# EAGLE board Synth (EAGLE 9.6.2), part 1 of 3
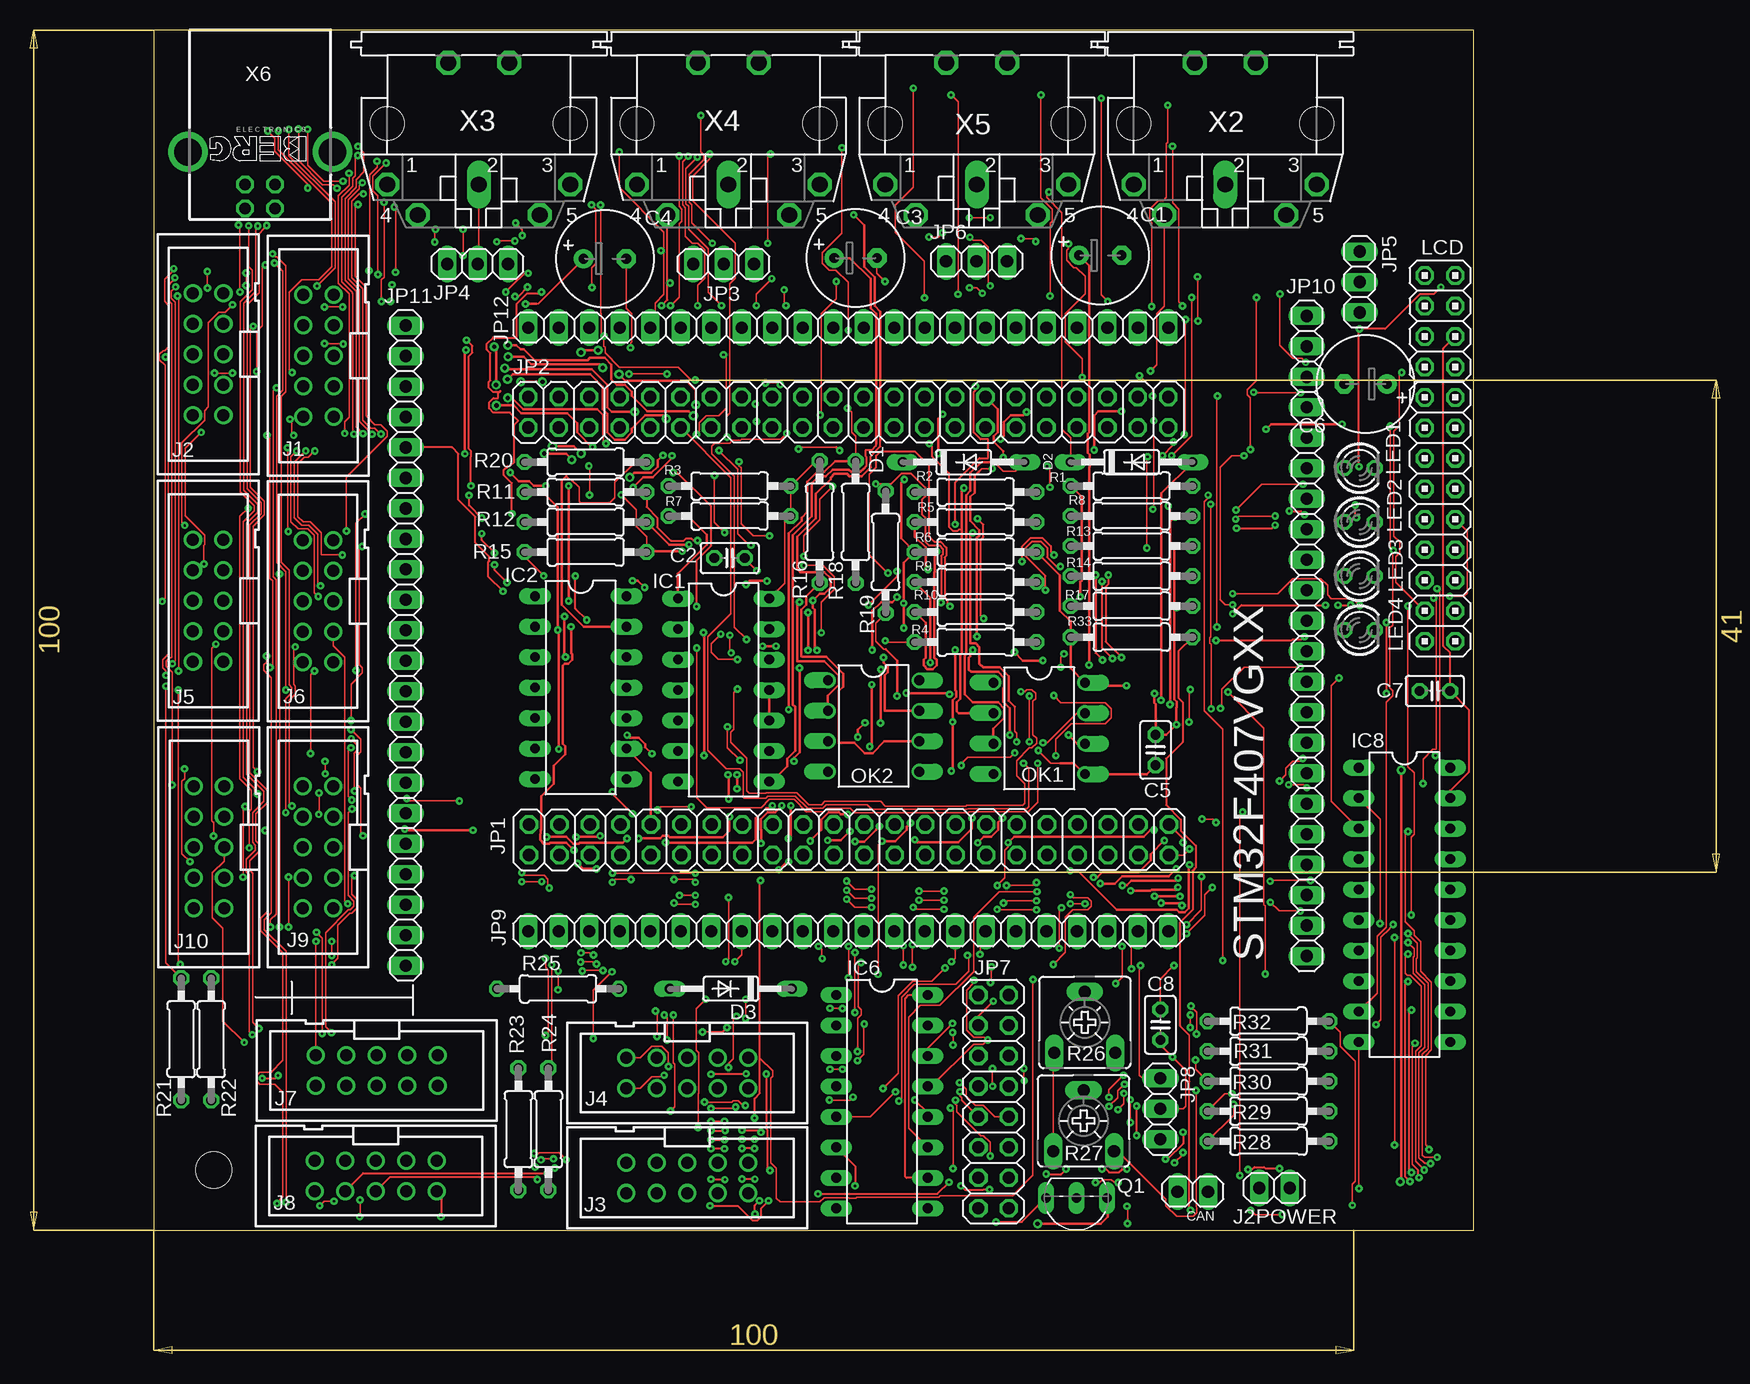
[diagram p3: board, top side]
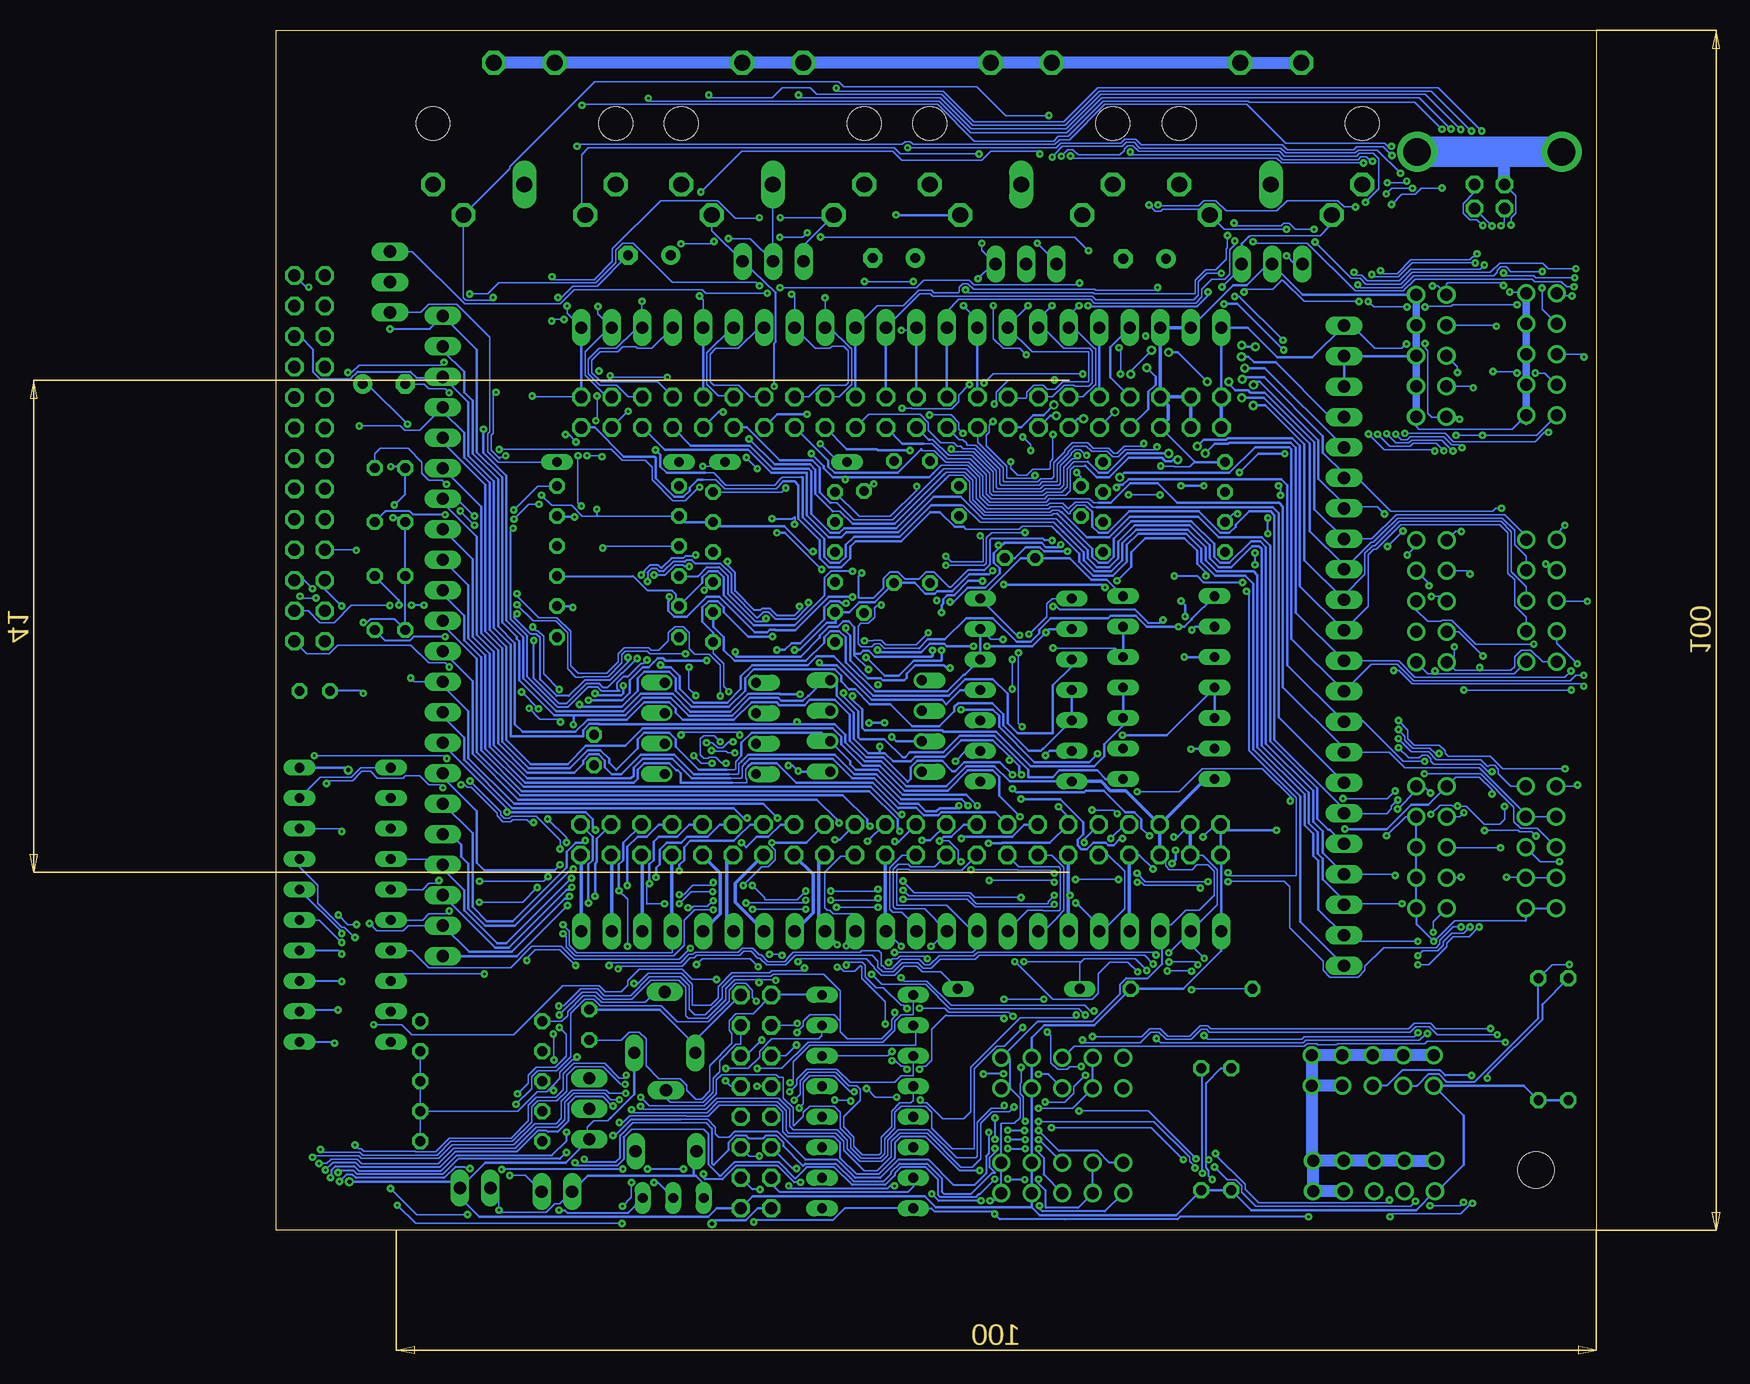
[diagram p4: board, bottom side, seen from below]

Size 110 x 100 mm. Coordinates in mm from the lower left corner, seen from the top.
Outline: 0,0 110,0 110,100 0,100 0,0
Copper layers (1*16): Top 0.035mm / dielectric 1.5mm / Bottom 0.035mm
Design rules "default *": minimum track width 0.13mm, minimum drill 0.2mm, track to track 0.15mm, track to pad 0.15mm, pad to pad 0.15mm, via to via 0.15mm, smd to smd 0.15mm, copper to edge 0.13mm, drill to drill 0.13mm, minimum pad ring 10mil, minimum via ring 8mil, stop-mask expansion 4mil, vias tented up to drill 0mil, thermal gap 10mil
Net classes: 0 default: clearance 0.15 mm
Holes 3 mm at 5,5

## Footprints (pad centres in the part's own frame; a part is rotated, then mirrored left to right if it is on the bottom)
E3,5-8 = drill 0.813 pad 1.6: + -1.778,0 | drill 0.813 pad 1.6 octagon: - 1.778,0
C025-025X050 = drill 0.813 octagon: 1 -1.27,0; 2 1.27,0
1X02 = drill 1.016 long: 1 -1.27,0; 2 1.27,0
DO35-10 = drill 0.813 long: A 5.08,0; C -5.08,0
DIL14 = drill 0.813 long: 1 -7.62,-3.81; 2 -5.08,-3.81; 3 -2.54,-3.81; 4 0,-3.81; 5 2.54,-3.81; 6 5.08,-3.81; 7 7.62,-3.81; 8 7.62,3.81; 9 5.08,3.81; 10 2.54,3.81; 11 0,3.81; 12 -2.54,3.81; 13 -5.08,3.81; 14 -7.62,3.81
DIL16 = drill 0.813 long: 1 -8.89,-3.81; 2 -6.35,-3.81; 3 -3.81,-3.81; 4 -1.27,-3.81; 5 1.27,-3.81; 6 3.81,-3.81; 7 6.35,-3.81; 8 8.89,-3.81; 9 8.89,3.81; 10 6.35,3.81; 11 3.81,3.81; 12 1.27,3.81; 13 -1.27,3.81; 14 -3.81,3.81; 15 -6.35,3.81; 16 -8.89,3.81
DIL20 = drill 0.813 long: 1 -11.43,-3.81; 2 -8.89,-3.81; 3 -6.35,-3.81; 4 -3.81,-3.81; 5 -1.27,-3.81; 6 1.27,-3.81; 7 3.81,-3.81; 8 6.35,-3.81; 9 8.89,-3.81; 10 11.43,-3.81; 11 11.43,3.81; 12 8.89,3.81; 13 6.35,3.81; 14 3.81,3.81; 15 1.27,3.81; 16 -1.27,3.81; 17 -3.81,3.81; 18 -6.35,3.81; 19 -8.89,3.81; 20 -11.43,3.81
PAK100/2500-10 = drill 1 pad 1.422: 1 -5.08,-1.27; 2 -5.08,1.27; 3 -2.54,-1.27; 4 -2.54,1.27; 5 0,-1.27; 6 0,1.27; 7 2.54,-1.27; 8 2.54,1.27; 9 5.08,-1.27; 10 5.08,1.27
2X22 = drill 1.016 octagon: 1 -25.4,-1.27; 2 -25.4,1.27; 3 -22.86,-1.27; 4 -22.86,1.27; 5 -20.32,-1.27; 6 -20.32,1.27; 7 -17.78,-1.27; 8 -17.78,1.27; 9 -15.24,-1.27; 10 -15.24,1.27; 11 -12.7,-1.27; 12 -12.7,1.27; 13 -10.16,-1.27; 14 -10.16,1.27; 15 -7.62,-1.27; 16 -7.62,1.27; 17 -5.08,-1.27; 18 -5.08,1.27; 19 -2.54,-1.27; 20 -2.54,1.27; 21 0,-1.27; 22 0,1.27; 23 2.54,-1.27; 24 2.54,1.27; 25 5.08,-1.27; 26 5.08,1.27; 27 7.62,-1.27; 28 7.62,1.27; 29 10.16,-1.27; 30 10.16,1.27; 31 12.7,-1.27; 32 12.7,1.27; 33 15.24,-1.27; 34 15.24,1.27; 35 17.78,-1.27; 36 17.78,1.27; 37 20.32,-1.27; 38 20.32,1.27; 39 22.86,-1.27; 40 22.86,1.27; 41 25.4,-1.27; 42 25.4,1.27; 43 27.94,-1.27; 44 27.94,1.27
1X03 = drill 1.016 long: 1 -2.54,0; 2 0,0; 3 2.54,0
2X08 = drill 1.016 octagon: 1 -8.89,-1.27; 2 -8.89,1.27; 3 -6.35,-1.27; 4 -6.35,1.27; 5 -3.81,-1.27; 6 -3.81,1.27; 7 -1.27,-1.27; 8 -1.27,1.27; 9 1.27,-1.27; 10 1.27,1.27; 11 3.81,-1.27; 12 3.81,1.27; 13 6.35,-1.27; 14 6.35,1.27; 15 8.89,-1.27; 16 8.89,1.27
1X22 = drill 1.016 long: 1 -26.67,0; 2 -24.13,0; 3 -21.59,0; 4 -19.05,0; 5 -16.51,0; 6 -13.97,0; 7 -11.43,0; 8 -8.89,0; 9 -6.35,0; 10 -3.81,0; 11 -1.27,0; 12 1.27,0; 13 3.81,0; 14 6.35,0; 15 8.89,0; 16 11.43,0; 17 13.97,0; 18 16.51,0; 19 19.05,0; 20 21.59,0; 21 24.13,0; 22 26.67,0
2X13 = drill 1.016 octagon: 1 -15.24,-1.27; 2 -15.24,1.27; 3 -12.7,-1.27; 4 -12.7,1.27; 5 -10.16,-1.27; 6 -10.16,1.27; 7 -7.62,-1.27; 8 -7.62,1.27; 9 -5.08,-1.27; 10 -5.08,1.27; 11 -2.54,-1.27; 12 -2.54,1.27; 13 0,-1.27; 14 0,1.27; 15 2.54,-1.27; 16 2.54,1.27; 17 5.08,-1.27; 18 5.08,1.27; 19 7.62,-1.27; 20 7.62,1.27; 21 10.16,-1.27; 22 10.16,1.27; 23 12.7,-1.27; 24 12.7,1.27; 25 15.24,-1.27; 26 15.24,1.27
LED3MM = drill 0.813 octagon: A -1.27,0; K 1.27,0
DIL08 = drill 0.813 offset: 1 -3.81,-3.81; 2 -1.27,-3.81; 3 1.27,-3.81; 4 3.81,-3.81; 5 3.81,3.81; 6 1.27,3.81; 7 -1.27,3.81; 8 -3.81,3.81
TO92-EBC = drill 0.813 long: B 0,-1.27; C -2.54,-1.27; E 2.54,-1.27
0207/10 = drill 0.813 octagon: 1 -5.08,0; 2 5.08,0
CA6V = drill 1.016 long: A -2.54,-2.54; E 2.54,-2.54; S 0,2.54
MAB5SH = drill 1.321 octagon: 1 7.62,5.08; 3 -7.62,5.08; 4 5.08,7.62; 5 -5.08,7.62; PE -2.54,-5.08; PE@ 2.54,-5.08 | drill 1.321 long: 2 0,5.08 | hole 2.794: 7.62,0; -7.62,0
PN61729-S = drill 0.95 octagon: 1 1.25,4.71; 2 -1.25,4.71; 3 -1.25,2.71; 4 1.25,2.71 | drill 2.3 pad 2.9: S1 -6.02,0; S2 6.02,0

## Placement (x,y rotation side)
C1  10uF  [E3,5-8]  78.89,81.22 0 top
C2  100nF  [C025-025X050]  48,56 0 top
C3  10uF  [E3,5-8]  58.5,81 0 top
C4  10uF  [E3,5-8]  37.61,80.94 0 top
C5  100nF  [C025-025X050]  83.5,40 270 top
C6  10uF  [E3,5-8]  101,70.5 180 top
C7  100nF  [C025-025X050]  106.77,44.92 0 top
C8  100nF  [C025-025X050]  83.9,17.1 90 top
CAN  CAN  [1X02]  86.6,3.2 180 top
D1  1N4148  [DO35-10]  67.5,64 0 top
D2  1N4148  [DO35-10]  81.5,64 0 top
D3  1N4148  [DO35-10]  48.1,20.1 180 top
IC1  74S00N  [DIL14]  47.5,45 270 top
IC2  74S00N  [DIL14]  35.6,45.2 270 top
IC6  74HC595N  [DIL16]  60.7,10.7 270 top
IC8  74HCT541N  [DIL20]  104.24,27.1 270 top
J1  AIN1  [PAK100/2500-10]  13.73,72.86 90 top
J2  AIN2  [PAK100/2500-10]  4.55,72.97 90 top
J2POWER  [1X02]  93.4,3.5 180 top
J3  TRI 5V DIN/OUT  [PAK100/2500-10]  44.47,4.35 180 top
J4  TRI 5V AOUT/SPI  [PAK100/2500-10]  44.47,13.08 180 top
J5  GPIO1  [PAK100/2500-10]  4.55,52.43 90 top
J6  GPIO2  [PAK100/2500-10]  13.7,52.4 90 top
J7  I2C 1  [PAK100/2500-10]  18.6,13.3 180 top
J8  I2C 2  [PAK100/2500-10]  18.5,4.5 180 top
J9  I2S  [PAK100/2500-10]  13.7,31.9 90 top
J10  SD/SPI  [PAK100/2500-10]  4.6,31.9 90 top
JP1  Header 22x2  [2X22]  56.68,32.52 0 top
JP2  Header 22x2  [2X22]  56.62,68.15 0 top
JP3  [1X03]  47.5,80.5 180 top
JP4  [1X03]  27,80.5 180 top
JP5  [1X03]  100.5,79 270 top
JP6  [1X03]  68.58,80.72 0 top
JP7  B_LCD  [2X08]  70,10.7 90 top
JP8  [1X03]  83.9,10.1 90 top
JP9  [1X22]  57.9,24.9 0 top
JP10  [1X22]  96.1,49.5 270 top
JP11  [1X22]  21,48.7 270 top
JP12  [1X22]  57.9,75.2 0 top
LCD  3.5 RPI LCD  [2X13]  107.2,64.3 270 top
LED1  [LED3MM]  100.5,63.5 0 top
LED2  [LED3MM]  100.5,59 0 top
LED3  [LED3MM]  100.5,54.5 0 top
LED4  [LED3MM]  100.5,50 0 top
OK1  6N138  [DIL08]  73.8,41.8 270 top
OK2  6N138  [DIL08]  60,42 270 top
Q1  BC546B  [TO92-EBC]  76.9,1.4 180 top
R1  220  [0207/10]  81.5,62 0 top
R2  220  [0207/10]  68.5,61.5 0 top
R3  220  [0207/10]  48,62 0 top
R4  220  [0207/10]  68.5,49 0 top
R5  4.7k  [0207/10]  68.5,59 0 top
R6  1k  [0207/10]  68.5,56.5 0 top
R7  100k  [0207/10]  48,59.5 0 top
R8  100k  [0207/10]  81.5,59.5 0 top
R9  220  [0207/10]  68.5,54 0 top
R10  100k  [0207/10]  68.5,51.5 0 top
R11  220  [0207/10]  36,61.5 0 top
R12  220  [0207/10]  36,59 0 top
R13  220  [0207/10]  81.5,57 0 top
R14  220  [0207/10]  81.5,54.5 0 top
R15  4.7k  [0207/10]  36,56.5 0 top
R16  1k  [0207/10]  55.5,59 90 top
R17  100k  [0207/10]  81.5,52 0 top
R18  100k  [0207/10]  58.5,59 90 top
R19  220  [0207/10]  61,56.5 90 top
R20  100k  [0207/10]  36,64 0 top
R21  2.2k  [0207/10]  2.3,15.9 90 top
R22  2.2k  [0207/10]  4.8,15.9 90 top
R23  2.2k  [0207/10]  30.4,8.4 90 top
R24  2.2k  [0207/10]  32.9,8.4 90 top
R25  1k  [0207/10]  33.7,20.1 0 top
R26  [CA6V]  77.6,17.3 0 top
R27  [CA6V]  77.5,9.1 0 top
R28  1k  [0207/10]  92.9,7.4 180 top
R29  1k  [0207/10]  92.9,9.9 180 top
R30  1k  [0207/10]  92.9,12.4 180 top
R31  1k  [0207/10]  92.9,14.9 180 top
R32  1k  [0207/10]  92.9,17.4 180 top
R33  10k  [0207/10]  81.5,49.4 180 top
X2  MI1  [MAB5SH]  89.3,92.2 180 top
X3  MO1  [MAB5SH]  27.1,92.2 180 top
X4  MI1  [MAB5SH]  47.9,92.2 180 top
X5  MO2  [MAB5SH]  68.6,92.2 180 top
X6  PN61729-S  [PN61729-S]  8.88,89.85 180 top

## Tracks (layer width: path | path; a pad name or v marks a point on that pad's centre or on a via)
+3V3  (via drill 0.2)
  Top 0.13: v35.61,23.1 36.49,23.1 v36.67,22.92 | JP8.3 82.42,12.64 82.15,12.91 82.15,21.95 v82.24,22.04 | v7.45,29.4 7.45,35.12 v7.62,35.3 | v13.76,34.64 13.79,34.66 v13.79,36.41 | v16.54,35.08 16.22,34.76 16.22,27.88 16.7,27.41 16.7,26.98 16.39,26.67 16.23,26.67 14.33,24.77 14.33,16.93 v14.83,16.44 | v32.65,22.64 32.66,22.62 32.66,21.89 32.9,21.65 32.9,16.45 v32.66,16.21 | v11.67,66.22 11.53,66.36 11.53,67.4 v11.37,67.56 | v15.8,73.84 14.28,73.84 v14.24,73.88 | v9.7,46.87 9.93,47.1 9.93,54.09 9.69,54.33 9.69,65.98 v9.45,66.22 | v11.54,35.32 11.29,35.57 11.29,44.14 11.81,44.66 11.81,45.32 11.66,45.47 11.66,48.45 v11.81,48.6
  Top 0.203: v48.62,37.94 v48.62,36.77 | v37.22,32.84 37.15,32.78 35.21,32.78 v35.19,32.76
  Bottom 0.13: JP9.2 35.57,23.1 v35.61,23.1 | v36.67,22.92 36.91,23.16 51.52,23.16 51.83,22.85 54.75,22.85 55.51,22.09 55.94,22.09 56.39,22.55 57.91,22.55 58.68,21.78 59.17,21.78 59.42,22.03 59.57,22.03 59.57,23.07 59.79,23.29 61.18,23.29 61.3,23.16 66.9,23.16 67.32,22.74 67.32,22.68 67.62,22.37 69.01,22.37 69.57,22.94 69.73,22.94 70.29,23.5 71.13,23.5 71.47,23.16 75.06,23.16 75.26,22.96 75.59,22.96 76.28,22.28 82,22.28 v82.24,22.04 | J6.2 12.39,47.28 | 12.39,47.28 11.74,46.63 9.72,46.63 | 9.72,46.63 7.11,46.63 6.79,46.95 6.79,47.75 6.22,48.32 5.42,48.32 4.45,47.35 J5.2 | J10.4 J10.3 5.91,29.4 v7.45,29.4 | 11.53,35.3 11.91,35.3 12.03,35.41 12.99,35.41 v13.76,34.64 | v13.79,36.41 14.36,36.98 J9.9 14.97,36.65 v16.54,35.08 | JP1.3 32.79,31.25 31.55,30.01 31.55,27.12 JP9.2 | v14.83,16.44 15.16,16.1 24.31,16.1 24.53,15.88 32.33,15.88 v32.66,16.21 | JP9.2 33.77,23.76 v32.65,22.64 | J2.2 4.95,66.22 v9.45,66.22 v11.67,66.22 | v11.37,67.56 11.59,67.78 J1.2 12.52,67.72 13.67,67.72 14.03,68.08 14.03,73.26 14.24,73.47 v14.24,73.88 | JP11.1 20.33,75.37 18.42,73.46 16.18,73.46 v15.8,73.84 | 9.72,46.63 9.7,46.66 v9.7,46.87 | 11.53,35.3 11.54,35.3 v11.54,35.32 | v11.81,48.6 11.81,47.87 12.39,47.28 | v7.62,35.3 7.62,34.22 8.03,33.81 9.31,33.81 10.8,35.3 11.53,35.3
  Bottom 0.203: JP2.2 JP12.1 29.02,75.2 26.55,72.73 23.64,72.73 JP11.1 | JP10.2 96.1,73.28 94.32,71.51 94.32,69.81 93.62,69.11 93.62,64.68 91.5,62.56 91.5,50.32 90.09,48.91 90.09,42.14 89.45,41.5 85.06,41.5 84.02,42.53 80.75,42.53 79.31,43.98 77.23,43.98 76.7,43.45 76.7,43.1 76.1,42.5 71.85,42.5 70.37,43.98 68.29,43.98 68.05,43.74 65.95,43.74 65.51,44.18 63.43,44.18 62.19,42.94 62.19,40.79 60.8,39.4 59.4,39.4 57.34,37.34 57.1,37.59 57.1,38.57 56.57,39.1 54.49,39.1 53.63,38.24 53.4,38.24 52.64,39 49.68,39 v48.62,37.94 | v48.62,36.77 48.32,36.47 42.65,36.47 42.52,36.59 41.02,36.59 39.23,34.8 38.48,34.8 37.89,34.21 37.89,33.5 37.23,32.84 v37.22,32.84 | JP1.4 34.85,32.76 v35.19,32.76
  Bottom 0.305: JP1.4 JP1.3 | JP2.1 31.22,68.57 31.68,69.03 31.29,69.42 JP2.2
+5V  (via drill 0.2, 0.35)
  Top 0.13: v7.92,83.69 7.92,80.27 8.23,79.97 8.23,78.34 7.23,77.34 7.23,61.53 8.4,60.37 8.4,59.94 7.47,59.01 7.47,37.73 8.42,36.78 8.42,36.57 v8.66,36.33 | v48.02,49.56 48.02,48.21 v48.13,48.1 | v47.82,41.94 47.82,40.19 v48.87,39.14 | IC1.14 52.6,53.91 52.6,59.02 R7.2 R3.2 55.16,64.08 R16.2
  Top 0.15: v100.25,59.36 100.14,59.47 v100.14,60.41 | v100.44,63.61 100.44,75.03 v100.5,75.09 102.62,75.09 105.52,77.99 106.69,77.99 v107.27,78.57 | v102.72,50.62 v102.72,44.73 v102.73,44.72
  Top 0.203: v103.97,38.33 103.97,4.11 v103.88,4.02 | v20.93,33.41 21.02,33.31 v26.62,33.31 | v32.76,32.76 34.41,32.76 34.96,32.2 35.42,32.2 35.5,32.28 39.11,32.28 v39.46,32.63 | v47.92,35.91 47.92,37.88 v47.86,37.94 | v59.84,45.44 59.84,40.45 v59.68,40.29 | v83.41,44.7 83.41,43.92 83.5,43.83 C5.1 84.39,41.27 v85.23,42.11 85.23,43.53 85.27,43.57 85.27,44.03 85.06,44.23 85.06,51.93 | v81.06,45.36 77.86,45.36 OK1.8 76.42,46.8 R33.2 76.42,50.71 75.51,51.62 75.51,54.57 R6.2 | 85.06,51.93 85.06,56.72 85.34,57 R13.2 | v85.27,51.87 85.12,51.87 85.06,51.93
  Bottom 0.13: 82.09,9.37 82.34,9.12 83.51,9.12 84.06,8.58 84.06,7.41 | X6.1 7.63,83.98 v7.92,83.69 | v8.66,36.33 8.66,36.67 9.73,37.74 11.67,37.74 J9.10 | IC1.14 48.25,49.56 v48.02,49.56 | v48.13,48.1 48.13,42.24 v47.82,41.94 | v48.87,39.14 48.87,39.43 48.91,39.47
  Bottom 0.15: 105.53,44.95 C7.1 102.93,44.92 v102.73,44.72 | v100.25,59.36 99.59,59.36 LED2.A LED3.A LED4.A 100.11,50.88 102.14,50.88 102.56,50.46 v102.72,50.62 | v100.14,60.41 99.23,61.32 LED1.A 99.34,63.61 v100.44,63.61 | v100.5,75.09 97.18,75.09 JP10.1 | LCD.2 107.5,78.57 v107.27,78.57
  Bottom 0.203: R21.1 R22.1 6.01,12.03 J7.10 11.02,9.53 11.02,5.43 13.22,3.23 J8.10 14.99,1.66 28.74,1.66 R23.1 R24.1 35,1.22 46.35,1.22 47.01,1.88 | 47.01,1.88 J3.4 J3.3 J4.4 J4.3 47.01,16.01 45.96,17.06 41.82,17.06 R25.2 34.4,20.1 31.23,23.27 JP9.1 31.23,31.2 JP1.1 JP1.2 | J9.10 13.96,35.45 15.39,35.45 17.43,33.41 v20.93,33.41 | 47.01,1.88 55.01,1.88 55.95,2.82 70.26,2.82 JP7.1 73.27,1.81 73.98,1.1 93.08,1.1 95.03,3.05 95.03,3.14 J2POWER.1 94.51,3.66 | JP8.1 84.06,7.41 85.86,5.6 92.57,5.6 94.51,3.66 | 82.09,9.37 80.14,11.32 R26.E | IC8.20 104.17,38.53 v103.97,38.33 | v103.88,4.02 94.87,4.02 94.51,3.66 | JP1.2 30.8,33.31 v26.62,33.31 | JP1.2 31.73,33.79 v32.76,32.76 | v39.46,32.63 39.65,32.63 40.2,32.08 40.66,32.08 40.85,32.26 41.89,32.26 42.42,31.73 42.88,31.73 43.2,32.06 43.2,32.53 42.74,32.99 42.74,33.99 44.66,35.91 v47.92,35.91 | v47.86,37.94 48.06,38.14 48.06,38.62 48.91,39.47 50.27,40.83 52.88,40.83 54.26,39.45 56.71,39.45 57.12,39.05 58.55,39.05 59.25,39.75 59.66,39.75 | 59.66,39.75 60.65,39.75 61.84,40.94 61.84,43.09 63.27,44.52 63.27,45.79 63.29,45.81 OK2.8 64.35,45.81 65.62,44.53 65.66,44.53 66.1,44.09 67.9,44.09 68.14,44.34 70.51,44.34 71.99,42.85 75.61,42.85 77.09,44.34 79.45,44.34 80.9,42.89 85.19,42.89 | JP10.1 93.27,73.33 93.27,64.83 91.15,62.71 91.15,50.65 89.95,49.45 89.95,49.27 89.73,49.05 89.73,45.82 86.8,42.89 85.19,42.89 | IC2.14 40.77,54.17 42.04,54.17 43.87,56 C2.1 47.93,56 IC1.14 | v59.68,40.29 59.68,39.77 59.66,39.75 | v85.23,42.11 85.19,42.15 85.19,42.89 | v83.41,44.7 83.28,44.58 81.21,44.58 81.06,44.72 v81.06,45.36
  Bottom 0.203: R17.2 85.39,52 v85.27,51.87
D0  (via drill 0.2)
  Top 0.13: v72.55,12.43 72.52,12.46 v72.52,13.46
  Bottom 0.13: JP7.9 72.09,11.97 v72.55,12.43 | v72.52,13.46 70.63,13.46 69.71,14.39 69.71,14.91 68.68,15.95 64.76,15.95 64.51,16.2 IC6.15
D1  (via drill 0.2)
  Top 0.13: v69.92,11.98 69.9,12 v69.9,13.46
  Bottom 0.13: JP7.10 v69.92,11.98 | v69.9,13.46 67.85,13.46 65.65,15.66 59.42,15.66 58.43,16.66 58.43,17.41 57.91,17.93 56.92,17.93 56.89,17.95 IC6.1
D2  (via drill 0.2)
  Top 0.13: JP7.7 70.11,9.43 69.14,10.41 68.46,10.41 67.64,11.23 67.71,11.3 67.71,11.73 v67.17,12.28
  Bottom 0.13: v67.17,12.28 66.89,12.56 66.89,14.03 65.53,15.38 56.7,15.38 56.7,16.86 IC6.2
D3  (via drill 0.2)
  Top 0.13: JP7.8 67.34,10.82 67.34,11.04 67.19,11.18 v67.19,11.52
  Bottom 0.13: v67.19,11.52 66.61,12.11 66.61,12.56 65.77,13.4 63.26,13.4 62.16,12.31 58.44,12.31 57.91,12.85 56.93,12.85 56.89,12.88 IC6.3
D4  (via drill 0.2)
  Top 0.13: v66.82,10.82 66.82,10.48 66.91,10.39 66.91,9.87 68.91,7.87 69.14,7.87 69.71,7.29 69.71,6.18 v69.72,6.17
  Bottom 0.13: IC6.4 56.89,10.79 57.09,10.59 58.03,10.59 58.71,9.91 58.71,8.59 59.57,7.72 59.57,6.46 59.75,6.28 61.13,6.28 61.83,6.98 61.83,7.72 62.69,8.59 62.69,9.44 61.3,10.82 61.3,11.73 61.61,12.04 62.28,12.04 63.37,13.12 65.65,13.12 66.33,12.45 66.33,11.31 v66.82,10.82 | v69.72,6.17 70.55,6.17 JP7.5
D5  (via drill 0.2)
  Top 0.13: v66.62,5.13 66.62,9.95 v66.39,10.18 | IC6.5 59.73,9.43 v61.82,11.52
  Bottom 0.13: JP7.6 66.97,5.13 v66.62,5.13 | v66.39,10.18 66.05,10.53 66.05,12.33 65.53,12.85 63.49,12.85 62.16,11.52 v61.82,11.52
D6  (via drill 0.2)
  Top 0.15: IC6.6 58.45,5.33 v58.45,3.68 | v69.66,3.38 69.15,3.38 69.14,3.36 67.59,3.36 v67.28,3.68
  Bottom 0.15: v58.45,3.68 58.82,3.68 59.05,3.45 67.05,3.45 v67.28,3.68 | v69.66,3.38 70.3,3.38 JP7.3
D7
  Bottom 0.15: IC6.7 56.89,3.61 57.35,3.15 68.03,3.15 68.73,3.85 JP7.4
GND  (via drill 0.2)
  Top 0.13: R27.A 74.96,14.66 R26.A | IC8.10 100.43,3.5 v100.46,3.46 | v94.05,1.29 91.78,1.29 v91.42,1.65 | C8.2 83.9,20.91 v85.03,22.04 | v87.88,61.24 87.88,61 87.57,60.7 87.57,43.26 89.1,41.73 v89.1,22.47 | v7.19,78.16 7.19,83.63 v7.08,83.74 | J7.9 13.52,24.05 v13.53,24.05 | v17.46,32.85 17.25,33.05 17.25,36.81 17.02,37.04 17.02,39.62 17.26,39.86 17.26,40.9 v16.46,41.7 | v13.08,39.72 13.08,46.26 v13.41,46.59 | X3.2 27.1,80.6 JP4.2 | v72.29,82.62 73.27,82.62 v73.51,82.38 | v76.24,82.18 76.24,81.78 76.1,81.64 76.1,80.8 76.69,80.2 76.9,80.2 77.65,79.46 77.65,78.04 75.97,76.37 75.97,74.03 77.39,72.62 v77.39,71.06 | v82.15,71.19 83.25,70.1 v83.25,69.49 | v83.35,67.44 83.35,60.14 v83.27,60.06 | R15.2 41.08,57.76 40.2,58.64 40.2,60.02 v38.96,61.26 | v36.33,61.25 36.33,63.6 v36.27,63.66 | v73.72,39.95 74.77,38.9 75.54,38.9 | v71.77,39.77 71.39,39.39 67.85,39.39 67.31,38.85 v67.31,38.7
  Top 0.15: IC8.19 108.05,36.62 109.6,38.16 109.6,43.36 C7.2 108.04,48.09 107.48,48.65 107.48,73.47 LCD.6 | v50.11,1.32 50.11,2.06 v50.49,2.44 | J8.2 23.96,2.85 v23.96,1.1 | v70.19,0.67 72.36,0.67 Q1.E
  Top 0.203: v66.48,38.24 66.59,38.35 v66.59,42.35 66.59,44.13 66.88,44.42 66.88,44.88 66.8,44.96 v66.8,48.34 | R15.2 41.13,56.55 v44.05,56.55 | 75.54,38.9 76.7,38.9 OK1.5 82.76,37.99 C5.2 | v50.28,54.94 49.27,55.94 C2.2 | R10.1 64.33,50.59 64.33,47.67 64.17,47.51 64.17,47.05 64.49,46.72 64.95,46.72 65.28,47.05 65.28,47.51 65.07,47.71 65.07,54.8 65.08,54.8 65.08,56.37 v65.24,56.53
  Bottom 0.13: J4.2 48.83,11.81 47.99,10.97 47.99,9.37 48.48,8.88 49.55,8.88 | IC8.1 102.93,38.53 103.72,37.74 106.3,37.74 IC8.19 | v100.46,3.46 98.28,1.29 v94.05,1.29 | J2POWER.2 91.42,2.79 v91.42,1.65 91.23,1.46 87.47,1.46 86.76,2.17 86.36,2.17 CAN.2 | v85.03,22.04 85.27,22.28 85.28,22.28 86.35,23.35 88.4,23.35 89.1,22.65 v89.1,22.47 | v87.88,61.24 87.02,60.38 85.34,60.38 84.47,59.5 83.16,59.5 | 83.16,59.5 R8.1 | 6.41,46.76 6.82,46.35 13.44,46.35 | J6.1 14,46.35 13.44,46.35 | J2.9 5.93,78.16 v7.19,78.16 | v7.08,83.74 7.08,84.36 6.69,84.75 6.69,86.2 X6.4 | J2.1 6.97,66.74 14.77,66.74 14.99,66.96 J1.1 | 5.87,25.77 11.77,25.77 13.52,24.02 13.52,24.03 13.78,24.29 | 14.92,25.46 14.08,24.62 14.08,24.6 13.78,24.29 | v13.53,24.05 13.77,24.29 13.78,24.29 | JP1.5 35.86,30.75 35.86,30.34 35.56,30.03 33.66,30.03 33.26,30.43 32.37,30.43 31.83,29.89 31.83,27.88 33.07,26.64 34.17,26.64 35.38,25.43 36.31,25.43 | J9.7 15.87,34.44 v17.46,32.85 | v16.46,41.7 16.46,41.67 15.95,41.16 15.95,40.82 15.26,40.13 13.83,40.13 13.42,39.72 v13.08,39.72 | v13.41,46.59 13.41,46.38 13.44,46.35 | X5.2 68.6,80.74 JP6.2 70.48,82.62 v72.29,82.62 | v73.51,82.38 73.71,82.18 v76.24,82.18 | v77.39,71.06 82.02,71.06 v82.15,71.19 | v83.25,69.49 83.25,67.54 v83.35,67.44 | v83.27,60.06 83.27,59.61 83.16,59.5 | v38.96,61.26 36.34,61.26 v36.33,61.25 | v36.27,63.66 35.16,63.66 35.1,63.6 33.86,63.6 33.44,64.02 | v71.77,39.77 72.34,39.77 72.46,39.89 73.31,39.89 73.38,39.95 v73.72,39.95
  Bottom 0.15: 96.03,71.02 98.29,71.02 98.8,71.53 103.2,71.53 103.8,70.93 106.34,70.93 106.92,71.51 106.92,73.39 107.99,74.46 LCD.6 | J2.1 5.82,67.12 | 14.61,67.39 J1.1 | 6.41,46.76 J5.1 | J10.2 J10.1 5.87,25.77 | 14.92,25.42 14.92,25.46 14.92,26.77 J9.1 J9.3 J9.5 J9.7 | v50.49,2.44 50.2,2.44 J3.2 J3.1 49.55,8.88 | J4.2 48.85,11.81 48.85,14.28 48.92,14.35 J4.1 46.51,17.39 41.95,17.39 39.66,19.68 39.66,20.47 39.15,20.98 37.34,20.98 36.14,22.18 36.14,24.76 36.31,24.93 | v23.96,1.1 34.65,1.1 34.87,0.89 44.27,0.89 49.67,0.89 v50.11,1.32 50.34,1.55 55.15,1.55 55.4,1.81 IC6.8 62.6,1.81 63.58,0.82 70.04,0.82 v70.19,0.67
  Bottom 0.203: CAN.2 84.01,4.52 75.19,4.52 | 75.19,4.52 75.03,4.52 74.36,3.85 Q1.E | 75.19,4.52 75.19,6.33 R27.A 75.06,6.66 | R26.A 75.06,15.41 | 75.06,15.41 75.06,15.8 JP7.15 | C8.2 78.02,18.37 75.06,15.41 | JP11.3 JP11.2 15.23,72.83 15.03,72.83 J1.5 | J1.9 24.44,77.94 JP4.2 27.34,80.5 29.12,78.72 30.25,78.72 JP12.2 | R20.1 33.42,64 33.44,64.02 JP2.5 | IC1.7 48.86,37.38 50.13,38.65 52.49,38.65 54.15,36.99 57.49,36.99 59.54,39.04 60.94,39.04 62.55,40.64 62.55,41.25 63.44,42.15 66.4,42.15 | 66.4,42.15 83.09,42.15 83.12,42.18 83.88,42.18 84.41,41.65 84.41,41.15 90.44,41.15 90.44,48.76 91.85,50.17 91.85,62.42 93.97,64.54 93.97,68.96 96.03,71.02 JP10.3 | OK2.5 66.43,38.19 v66.48,38.24 66.94,38.7 v67.31,38.7 | v66.59,42.35 66.4,42.16 66.4,42.15 | C2.2 48.43,56 47.52,56.91 46.35,56.91 45.99,56.55 v44.05,56.55 | v66.8,48.34 66.37,48.34 64.09,50.62 63.35,50.62 63.35,51.43 R10.1 62.21,51.5 61.38,52.33 60.09,52.33 R18.1 56.79,53.92 55.88,53.01 55.12,53.01 54.89,53.24 53.64,53.24 52.24,54.64 50.57,54.64 v50.28,54.94 | v65.24,56.53 65.53,56.53 67.65,58.66 73.23,58.66 R5.2 75.92,59 R8.1
  Bottom 0.305: JP9.3 36.31,24.93 36.31,25.43 | JP1.5 JP1.6 | JP1.6 32.57,37.58 IC2.7 | JP1.6 39.19,36.62 40.47,36.62 41.23,37.38 IC1.7 | JP2.3 JP2.4 JP2.6 | JP2.6 35.63,68.75 35.63,67.55 JP2.5 | JP2.6 36.3,75.07 | 36.3,75.07 JP12.3 | JP12.2 36.17,75.2 36.3,75.07
  Bottom 0.61: J1.1 J1.3 15,72.6 15.23,72.83 | J1.5 J1.7 J1.9 | J2.1 J2.3 J2.5 J2.7 J2.9
  Bottom 1.016: X6.4 7.63,89.63 7.85,89.85 | J7.9 J7.7 J7.5 J7.3 J7.1 J7.2 | J7.4 J7.2 | J7.2 23.68,5.87 J8.1 | J8.1 J8.2 J8.4 | J8.9 J8.7 J8.5 J8.3 J8.1
  Bottom 2.54: X6.S1 7.85,89.85 X6.S2
  pour Bottom: 0,0 0,99.9 0,0.1
N$1  (via drill 0.2)
  Top 0.15: v64.64,65.52 64.86,65.3 64.86,64.48 66.27,63.07 66.27,58.59 66.58,58.28 67.02,58.28 67.13,58.39 67.36,58.39
  Top 0.203: OK1.2 67.1,43.07 66.94,43.23 66.94,43.98 67.23,44.27 67.23,45.02 67.21,45.05 67.21,47.97 67.36,48.11 67.36,58.39 67.36,61.66 v67.52,61.83
  Bottom 0.13: R2.2 67.85,61.5 v67.52,61.83
  Bottom 0.15: D1.C 63.12,64 v64.64,65.52
N$2  (via drill 0.2)
  Top 0.13: D1.A 71.82,63.24 70.83,63.24 70.06,64 69.7,64 | v91.9,77.72 91.9,70.77 91.16,70.03 91.16,69.59 91.4,69.35 v91.4,65.04 | v74.69,61.9 74.69,63.39 v74.44,63.64 | v45.6,92.87 45.6,89.85 45.83,89.61 45.83,89.19 44.64,87.99 44.64,85.65 44.87,85.43 44.87,83.92 v46.56,82.23
  Top 0.203: OK1.3 69.99,41.78 70.9,42.69 70.9,43.45 70.37,43.98 68.26,43.98 67.59,44.65 67.59,47.84 67.71,47.97 67.71,61.23 68.08,61.6 68.08,62.06 68.05,62.08 68.05,63.1 68.95,64 69.7,64
  Bottom 0.13: v91.9,77.72 92.14,77.48 94.17,77.48 94.38,77.69 X2.5 90.51,88.45 90.51,88.61 83.45,95.67 63.09,95.67 62.69,95.26 51.59,95.26 49.2,92.87 v45.6,92.87 | v91.4,65.04 82.06,65.04 81.15,64.13 79.23,64.13 78.66,63.56 78.66,62.51 76.93,60.77 75.91,60.77 74.79,61.9 v74.69,61.9 | v74.44,63.64 72.94,63.64 D1.A | v46.56,82.23 44.96,80.63 JP3.3
N$3  (via drill 0.2)
  Top 0.13: X2.4 84.22,76.99 83.59,76.37 83.59,72.09 v83.08,71.59 | v51.18,82.23 51.18,89.44 v51.41,89.67 | v56.6,61.97 55.51,60.88 55.51,59.2 54.18,57.87 v54.18,56.14 | v51.32,57.85 49.95,57.85 48.95,58.85 48.95,63.5 48.77,63.68 v48.77,64.02 | v45.25,66.28 45.48,66.51 45.48,67.28 46.05,67.86 47.11,67.86 47.72,68.47 47.72,72.7 v47.48,72.94 | v50.23,77.03 50.23,78 v51.51,79.28
  Bottom 0.13: v51.18,82.23 51.18,81.64 JP3.1 50.29,80.5 v51.51,79.28 | v51.41,89.67 57.97,89.67 58.49,90.19 83.96,90.19 84.53,89.62 84.53,84.89 X2.4 | R2.1 61.38,59.46 58.8,59.46 56.6,61.66 v56.6,61.97 | v54.18,56.14 53.73,55.7 51.08,55.7 51.08,57.61 v51.32,57.85 | v48.77,64.02 48.77,63.48 48.2,62.91 47.43,62.91 46.95,63.38 45.58,63.38 45.48,63.49 45.48,64.03 45.25,64.26 v45.25,66.28 | v47.48,72.94 48,73.46 49.41,73.46 50.23,74.28 v50.23,77.03
N$4  (via drill 0.2)
  Top 0.13: D2.C 76.42,66.02 75.69,66.75 75.69,84.79 74.43,86.05 74.43,86.32 v74.6,86.49 | v46.35,89.67 46.35,89.26 44.92,87.83 44.92,85.77 48.48,82.21 48.48,79.33 48,78.86 48,68.04 47.78,67.83 v47.78,66.09 | v47.11,64.95 48.67,63.38 48.67,58.02 49.63,57.06 v49.78,57.06
  Top 0.203: OK2.2 56.19,44.52 57.1,45.43 57.1,46.19 55.89,47.4 53.63,47.4 53.63,52.2 53.76,52.33 v53.83,52.33 | v44.6,57.11 42.97,57.11 R12.2
  Bottom 0.13: v74.6,86.49 71.18,89.91 58.61,89.91 57.85,89.15 51.2,89.15 50.44,89.91 46.47,89.91 46.35,89.79 v46.35,89.67 | v47.78,66.09 47.11,65.42 v47.11,64.95 | v49.78,57.06 49.5,57.06 49.41,57.15
  Bottom 0.203: v53.83,52.33 53.55,52.33 52.35,53.53 50.9,53.53 49.7,54.73 49.7,55.15 50.18,55.62 50.18,56.38 49.41,57.15 49.3,57.27 46.21,57.27 45.85,56.91 44.8,56.91 v44.6,57.11
N$5  (via drill 0.2)
  Top 0.13: 71.74,43.6 71.74,41.58 71.92,41.41 v71.92,40.68 | 77.09,43.07 76.95,43.07 74.48,40.61 v74.12,40.61
  Top 0.203: 77.09,43.07 OK1.7 | v68.26,58.1 68.06,57.9 68.06,48.9 68.49,48.9 68.82,48.57 68.82,47.18 69.12,46.88 70.51,46.88 71.25,46.13 71.25,44.09 71.74,43.6 | v64.53,55.03 64.33,55.23 64.33,56.88 63.42,57.79 R5.1
  Bottom 0.13: v71.92,40.68 72.25,40.68 72.77,40.17 73.19,40.17 73.63,40.61 v74.12,40.61
  Bottom 0.203: v68.26,58.1 67.59,58.1 v64.53,55.03
N$6  (via drill 0.2)
  Top 0.13: v25.79,83.39 v25.79,81.19 v25.79,81.18 | R4.1 61.07,49 v60.97,49.1 | v55.64,49.77 55.64,52.33 56.73,53.41 56.73,54.43 55.77,55.39 v54.18,55.39 | v37.25,85.42 37.25,76.41 37.29,76.37 37.29,74.74 v37.52,74.5 37.52,73.66 37.63,73.56 37.63,73.1 38.82,71.91 43.7,71.91 44.79,70.82 v45.13,70.82 | v47.59,58.12 46.74,58.97 v46.74,62.86 | v50.25,67.38 50.25,68.73 v50.14,68.84
  Bottom 0.13: v25.79,83.39 30.99,83.39 X3.5 32.67,85.07 36.12,85.07 36.27,84.91 36.74,84.91 v37.25,85.42 | v25.79,81.18 25.11,80.5 JP4.3 | v60.97,49.1 60.24,49.1 60.21,49.13 59.55,49.13 59.19,48.77 56.65,48.77 v55.64,49.77 | v54.18,55.39 50.99,55.39 50.8,55.58 50.8,57.68 50.36,58.12 v47.59,58.12 | v46.74,62.86 46.98,62.63 49.12,62.63 49.12,63.64 50.82,65.34 50.82,66.22 50.56,66.47 50.56,67.07 v50.25,67.38 | v50.14,68.84 49.98,69.01 49.98,69.83 48.98,70.82 v45.13,70.82
N$7  (via drill 0.2)
  Top 0.15: 59.77,63.55 59.77,64.5 60.57,65.31 60.57,65.81
  Top 0.203: v58.69,41.09 58.69,41.67 v59.29,42.27 | v60.58,42.25 60.58,46.68 v60.62,46.72 | v71.73,48.17 72.44,47.46 v74.1,47.46 | v83.96,44.15 83.96,61.38 D2.A | 59.77,63.55 59.02,62.81 57.98,62.81 57.78,63.01 56.71,63.01 56.41,62.7 56.41,62.56 55.2,61.35 55.2,59.33 53.63,57.76 53.63,55.08 53.87,54.83 55.88,54.83 56.41,54.3 56.41,53.54 55.88,53.01 55.49,53.01 v54.94,52.45 54.94,51.85 55.09,51.7 55.09,48.51 v55.29,48.31 | 60.57,65.81 60.57,76.54 60.1,77.01 60.1,79.41 59.23,80.28 59.23,83.71 v58.34,84.6
  Bottom 0.13: D2.A 91.49,64 92.36,64.86 92.36,66.35 92.19,66.52 92.19,74.41 94.93,77.15 97.27,77.15 97.95,76.46 JP5.3
  Bottom 0.203: OK2.3 58.33,40.73 v58.69,41.09 | v59.29,42.27 60.56,42.27 v60.58,42.25 | v60.62,46.72 61.8,47.9 61.8,48.01 | 61.8,48.01 61.8,50.24 62.28,50.72 62.74,50.72 63.2,50.27 63.94,50.27 64.69,49.52 64.69,49.38 66.28,47.79 71.64,47.79 71.88,48.02 v71.73,48.17 | v74.1,47.46 77.55,47.46 77.72,47.63 78.18,47.63 78.5,47.31 78.5,47.3 78.93,46.88 79.45,46.88 80.51,45.82 80.51,44.78 81.14,44.15 v83.96,44.15 | 61.8,48.01 61.31,48.01 61.06,48.27 60.6,48.27 60.11,47.78 55.37,47.78 55.29,47.86 v55.29,48.31 | X4.5 58.32,84.58 v58.34,84.6
N$8  (via drill 0.2)
  Top 0.15: v43.28,63.12 43.66,63.12 46.42,60.36 46.42,56.96 45.24,55.78 45.24,52.25 45.1,52.11 v45.26,51.95 | v36.09,50.84 35.14,51.78 v35.14,54.51 | v29.45,53.96 28.41,55 v28.41,55.44 | v28.41,56.43 27.35,57.49 v27.35,58.03 | v27.35,59.33 26.29,60.39 v26.29,61.22 | v26.45,62.02 26.45,64.45 26.46,64.47 26.46,64.91 26.26,65.11 26.26,72.81 26.56,73.11 26.56,73.67 v26.07,74.16 | v30.11,77.79 30.37,77.79 v31.17,78.59
  Bottom 0.13: 28.95,82.78 28.9,82.78 28.81,82.87 22.98,82.87 22.21,83.64 22.21,84.58
  Bottom 0.15: R3.1 42.92,62.77 v43.28,63.12 | v45.26,51.95 44.94,51.95 44.72,51.73 38.45,51.73 37.31,50.6 36.33,50.6 v36.09,50.84 | v35.14,54.51 33.25,54.51 32.73,53.98 29.47,53.98 v29.45,53.96 | v28.41,55.44 v28.41,56.43 | v27.35,58.03 v27.35,59.33 | v26.29,61.22 26.29,61.85 v26.45,62.02 | v26.07,74.16 29.71,77.79 v30.11,77.79 | v31.17,78.59 29.54,80.22 29.54,80.88
  Bottom 0.203: 22.21,84.58 X3.4 | JP4.1 29.54,80.88 29.54,82.19 28.95,82.78
N$9  (via drill 0.2)
  Top 0.203: v45.87,39.55 45.87,49.76 v45.83,49.8 | v50.76,48.65 v51.87,48.65 | v61.95,52.74 61.54,52.33 60.62,52.33 59.88,51.59 v59.88,48.34 | v77.22,52.77 77.22,54.01 77.33,54.12 77.33,61.09 R1.1
  Bottom 0.203: IC1.6 45.5,39.92 v45.87,39.55 | IC1.2 45.55,50.08 v45.83,49.8 46.98,48.65 v50.76,48.65 | v51.87,48.65 54.1,48.65 54.3,48.86 55.52,48.86 56.25,48.13 59.73,48.13 59.88,48.29 v59.88,48.34 | v61.95,52.74 62.24,52.74 62.28,52.78 63.92,52.78 66.75,49.96 68.34,49.96 68.39,50.01 68.85,50.01 69.05,49.8 70.09,49.8 73.06,52.77 74.1,52.77 75.78,51.09 76.8,51.09 77.33,51.62 77.33,52.38 77.22,52.49 v77.22,52.77
N$10  (via drill 0.2)
  Top 0.13: v86.51,77.72 86.51,66.19 v84.84,64.53 | v84.56,60.32 84.71,60.17 84.71,59.01
  Top 0.203: v84.71,43.8 84.71,59.01 v85.12,59.42
  Bottom 0.13: C1.- 83.25,78.64 85.25,78.64 86.17,77.72 v86.51,77.72 | v84.84,64.53 84.84,60.61 v84.56,60.32
  Bottom 0.203: IC1.4 IC1.5 46.04,40.11 46.1,40.11 46.26,39.95 47.26,39.95 49.38,42.07 49.38,42.98 50.31,43.91 53.15,43.91 53.48,43.59 53.48,43.24 54.72,41.99 56.98,41.99 58.81,43.83 60.51,43.83 61.73,45.05 62.19,45.05 62.21,45.03 62.9,45.72 62.9,46.19 63.43,46.72 70.17,46.72 70.9,45.99 70.9,44.95 72.25,43.59 75.35,43.59 76.7,44.95 76.7,45.99 77.23,46.52 79.31,46.52 79.84,45.99 79.84,44.95 81.19,43.59 84.51,43.59 v84.71,43.8 | v85.12,59.42 86.5,59.42 R8.2
N$11  (via drill 0.2)
  Top 0.203: v77.95,47.08 77.95,63.58 77.99,63.62 77.99,64.6 77.83,64.77 77.83,66.33 77.96,66.47 77.96,80.37 C1.+
  Bottom 0.203: IC1.3 43.69,46.95 45.26,45.38 45.26,41.39 45.27,41.38 48.19,41.38 49.03,42.22 49.03,44.67 50.27,45.91 52.55,45.91 53.92,44.53 60.22,44.53 63.52,47.83 64.95,47.83 65.7,47.08 70.31,47.08 71.25,46.13 71.25,45.09 72.4,43.95 75.2,43.95 76.34,45.09 76.34,46.13 77.09,46.88 77.91,46.88 77.95,46.91 v77.95,47.08
N$12  (via drill 0.2)
  Top 0.13: v90.19,59.99 92.35,62.15 v95.79,62.15
  Bottom 0.13: R1.2 88.19,62 v90.19,59.99 | v95.79,62.15 96.14,62.49 97.27,62.49 97.84,63.06 97.84,63.99 98.98,65.13 101.33,65.13 101.77,64.69 LED1.K
N$13  (via drill 0.2)
  Top 0.203: IC1.11 IC1.10 | v64.72,47.28 64.72,52.7 R9.1
  Bottom 0.203: IC1.11 52.96,45 54.13,43.83 54.49,44.18 60.36,44.18 63.26,47.08 64.52,47.08 v64.72,47.28
N$14  (via drill 0.2)
  Top 0.13: C3.- 60.28,79.72 v60.96,79.04 | v56.89,79.04 56.89,77.6 55.64,76.36 55.64,68.02 v55.55,67.92 | v49.41,49.21 48.39,50.23 48.39,54.25 48.4,54.26 48.4,62.8 46.5,64.7 46.5,65.3 46.77,65.57 47.99,65.57 48.23,65.81 48.9,65.81 48.99,65.9 52.27,65.9 v52.76,66.39
  Bottom 0.13: v60.96,79.04 v56.89,79.04 | v52.76,66.39 53.1,66.74 53.1,67.28 53.74,67.92 v55.55,67.92 | v49.41,49.21 50.44,49.21 IC1.13
  Bottom 0.203: IC1.13 IC1.12 52.59,46.27 52.69,46.27 54.07,44.89 60.07,44.89 62.51,47.33 62.51,49.38 63.04,49.91 63.8,49.91 64.33,49.38 64.33,48.95 65.85,47.43 71.78,47.43 72.67,48.32 72.67,49.38 73.58,50.29 R10.2
N$15
  Top 0.15: 60.22,65.51 60.19,65.48 60.19,65.35 59.84,65 59.35,65 59.32,64.97 59.32,64.51 59.38,64.45 59.38,63.68 59.16,63.45
  Top 0.203: IC1.8 51.54,37.38 52.81,38.66 52.81,39.29 53.48,39.95 53.48,43.59 53.27,43.79 53.27,57.9 54.84,59.47 54.84,62.22 55.44,62.81 56.02,62.81 56.58,63.37 57.92,63.37 58.12,63.17 58.88,63.17 59.16,63.45 | 60.22,65.51 60.22,76.35 59.75,76.81 59.75,79.26 58.01,81 C3.+
N$16  (via drill 0.2)
  Top 0.15: v74.31,53.32 74.31,54.51 72.69,56.13 72.69,56.87 73.21,57.38 73.95,57.38 74.47,56.87 74.47,56.08 75.4,55.14 v75.56,55.3 | v78.5,54.58 78.5,48.09 v79.08,47.51 | v90.24,58.48 93.21,58.48 v93.47,58.74 | v94.64,59.91 95.6,59.91 v95.9,59.6
  Bottom 0.15: R9.2 74.26,53.32 v74.31,53.32 | v75.56,55.3 75.97,55.3 76.05,55.38 76.79,55.38 77.59,54.58 v78.5,54.58 | v79.08,47.51 79.39,47.2 79.59,47.2 80.69,46.1 81.07,46.1 81.59,45.58 81.59,45.14 81.39,44.94 81.39,44.91 82.86,44.91 83.19,45.23 84.02,45.23 85.69,43.57 86.52,43.57 89.05,46.1 89.05,49.51 90.45,50.91 90.45,58.27 v90.24,58.48 | v93.47,58.74 v94.64,59.91 | v95.9,59.6 98.58,59.6 98.86,59.88 100.89,59.88 LED2.K
N$17  (via drill 0.2)
  Top 0.13: 32.44,78.06 v32.33,78.17 | v69.06,78.06 68.6,78.52 v68,78.52 | v43.05,78.91 42.82,79.14
  Top 0.15: v29.87,59.68 29.87,62.23 29.19,62.91 29.19,63.34 29.5,63.65 29.69,63.65 30.04,64 30.04,67.09 30.37,67.42 29.68,68.11 28.32,68.11 27.97,68.46 27.97,68.96 28.32,69.31 28.71,69.31 28.71,69.74 28.79,69.82 | 28.89,69.92 28.79,69.82 | 28.79,69.82 28.29,69.82 27.94,70.17 27.94,70.67 28.07,70.8 28.07,73.07 27.78,73.36 27.78,73.86 28.29,74.37 30.18,74.37 | 30.18,74.37 30.24,74.37 | 30.18,74.37 30.24,74.43 30.24,77.18 31.13,78.06 32.44,78.06 | v42.33,77.03 42.82,77.52 42.82,79.14 X4.4
  Bottom 0.13: v32.33,78.17 32.33,77.88 33.26,76.95 | JP5.1 98.63,81.54 94.29,77.2 86.29,77.2 85.14,78.36 74.5,78.36 74.2,78.06 v69.06,78.06 | v68,78.52 56.64,78.52 56.02,79.14 52.22,79.14 51.84,78.76 43.19,78.76 v43.05,78.91
  Bottom 0.15: R12.1 30.24,59.68 v29.87,59.68 | v42.33,77.03 42.25,76.95 33.26,76.95
N$18  (via drill 0.2)
  Top 0.15: v69.17,50.95 68.94,51.18 68.94,57.53 69.14,57.73 69.14,58.79 v68.66,59.28 | v66.8,58.81 66.8,62.31 68.81,64.33 69.54,64.33 69.54,65.89 68.91,65.89 68.33,66.47 68.33,69.83 68.61,70.11 68.61,70.25 68.56,70.3 v68.49,70.3
  Bottom 0.13: X5.5 73.68,83.28 JP6.3
  Bottom 0.15: R14.1 74.83,54.5 74.09,55.24 73.07,55.24 72.34,54.51 72.34,53.01 70.05,50.72 69.4,50.72 v69.17,50.95 | v68.66,59.28 66.94,59.28 66.79,59.43 v66.79,58.82 v66.8,58.81 | v68.49,70.3 68.49,73.89 68.34,74.03 68.34,78.12 JP6.3
N$19  (via drill 0.2)
  Top 0.13: v82.77,56.83 82.77,59.83 82.75,59.84 82.75,64.36 v82.83,64.44 | v84.08,64.53 84.99,65.43 v84.99,65.67 | v85.88,66.3 85.99,66.41 v85.99,75.89 | v87.03,75.76 87.03,79.4 v86.99,79.44 | v69.72,84.36 v67.98,84.36
  Bottom 0.13: X5.4 63.58,84.53 63.74,84.36 | 63.74,84.36 66.04,82.06 JP6.1 | R13.1 82.6,57 v82.77,56.83 | v82.83,64.44 82.92,64.53 v84.08,64.53 | v84.99,65.67 85.62,66.3 v85.88,66.3 | v85.99,75.89 86.9,75.89 v87.03,75.76 | v86.99,79.44 86.75,79.2 83.48,79.2 81.96,80.72 81.96,81.76 77.93,85.79 73.18,85.79 71.72,84.33 69.75,84.33 v69.72,84.36 | v67.98,84.36 63.74,84.36
N$20  (via drill 0.2)
  Top 0.203: OK2.7 60.93,43.27 60.93,46.25 61.17,46.49 61.17,46.95 60.83,47.29 v60.83,47.71 | v51.13,54.09 49.67,54.09 v49.36,53.78 | v40.92,53.55 40.36,54.1 v39.91,54.1 | v32.51,54.51 30.92,56.1 R15.1 | v54.53,51.47 v54.53,48.31
  Bottom 0.203: v60.83,47.71 59.29,46.17 58.12,46.17 56.86,47.43 54.63,47.43 | v51.13,54.09 52.29,54.09 53.49,52.88 54,52.88 54.06,52.88 54.38,52.56 54.38,52.22 54.53,52.07 v54.53,51.47 | v49.36,53.78 41.16,53.78 v40.92,53.55 | v39.91,54.1 38.74,55.27 38.74,56.47 37.54,57.66 34.3,57.66 33.24,56.6 33.24,55.54 32.51,54.8 v32.51,54.51 | 54.63,47.43 54.57,47.43 | v54.53,48.31 54.53,47.52 54.63,47.43
N$21  (via drill 0.2)
  Top 0.203: v33.76,40.07 33.76,49.91 v33.68,49.99 33.68,60.23 32.41,61.5 R11.1
  Bottom 0.203: IC2.6 33.71,40.12 v33.76,40.07 | v33.68,49.99 33.39,50.28 IC2.2
N$22  (via drill 0.2)
  Top 0.13: C4.- 39.39,76.81 39.83,76.37 39.83,74.03 39.75,73.95 v39.75,73.52 | v50.99,70.59 52.09,70.59 v52.22,70.46 | v42.77,71.34 v39.61,71.34 | R18.2 58.5,66.16 58.18,66.47 58.18,68.14 v57.83,68.49
  Top 0.203: v39.46,41.23 39.66,41.03 40.45,41.03 40.98,40.5 40.98,40.25 v41.54,39.69 | v52.92,43.36 52.92,58.05 53.99,59.12 53.99,59.34 54.49,59.84 54.49,62.37 55.29,63.17 55.88,63.17 56.79,64.08 R18.2
  Bottom 0.13: v42.77,71.34 50.25,71.34 v50.99,70.59 | v39.61,71.34 39.61,73.38 v39.75,73.52 | v52.22,70.46 53.1,69.58 53.1,69.02 53.67,68.44 57.02,68.44 57.07,68.49 v57.83,68.49
  Bottom 0.203: IC2.5 IC2.4 35.76,41.23 v39.46,41.23 | v41.54,39.69 42.23,39 46.81,39 49.74,41.93 49.74,42.84 50.27,43.37 52.35,43.37 52.36,43.36 v52.92,43.36
N$23  (via drill 0.2)
  Top 0.13: 31.87,77.18 32.07,77.18 C4.+
  Top 0.203: v34.31,47.75 34.23,47.83 v34.23,51.12 | v34.59,52.42 v34.59,62.02 | v32.68,62.02 31.7,62.02 31.3,62.41 30.43,62.41 v29.72,63.12 | v25.93,64.69 25.93,73.23 v26.03,73.33 | v30.99,77.18 31.87,77.18
  Bottom 0.203: IC2.3 v34.3,47.74 v34.31,47.75 | v34.23,51.12 34.23,52.07 v34.59,52.42 | v34.59,62.02 v32.68,62.02 | v29.72,63.12 28.16,64.69 v25.93,64.69 | v26.03,73.33 29.88,77.18 v30.99,77.18 | 35.63,80.94 C4.+
N$24  (via drill 0.2)
  Top 0.13: v61.2,54.74 59.65,56.28 59.65,62.98
  Top 0.15: R11.2 41.08,60.25 41.97,59.37 41.97,58.58 43.1,57.44 44.19,57.44 44.38,57.64 44.82,57.64 45,57.46 v45.32,57.46 | 59.65,62.98 60.22,63.55 60.22,64.53 60.58,64.89 63.45,64.89 64.61,63.73 64.61,57.82 65.07,57.36 65.58,57.36 66.07,56.87 66.07,56.19 65.93,56.05 65.93,52.74 66.16,52.51 66.16,52.19 v66.38,51.97 | v72.37,55.71 72.39,55.74 72.39,56.99 73.09,57.69 74.07,57.69 74.77,56.99 74.77,56.52 v75.03,56.26 | v79.56,54.58 79.56,53.82 79.33,53.59 79.33,49.04 v80.66,47.71 | v89.92,51.35 90.64,52.07 v97.66,52.07 | v98.7,52.07 99.74,52.07 v99.76,52.09
  Bottom 0.15: v45.32,57.46 45.94,57.46 46.07,57.59 50.4,57.59 50.51,57.48 50.51,55.49 50.48,55.46 50.5,55.46 50.99,54.97 52.37,54.97 53.78,53.56 53.89,53.56 55.13,54.8 55.87,54.8 56.43,54.25 57.57,54.25 58.13,54.8 58.87,54.8 59.38,54.29 59.38,53.5 60.22,52.66 61.42,52.66 61.42,54.51 v61.2,54.74 | v66.38,51.97 66.38,51.65 66.82,51.2 68.25,51.2 68.83,51.78 69.51,51.78 69.63,51.66 70.14,51.66 71.74,53.26 71.74,54.76 72.66,55.68 72.63,55.71 v72.37,55.71 | v75.03,56.26 75.16,56.13 75.91,56.13 76.05,55.98 77.03,55.98 77.84,55.18 77.93,55.18 78.16,55.41 78.85,55.41 79.33,54.92 79.33,54.81 v79.56,54.58 | v80.66,47.71 80.66,47.36 82.19,45.83 84.27,45.83 85.59,44.51 86.61,44.51 88,45.89 88,49.35 88.31,49.66 88.77,49.66 90.15,51.04 90.15,51.12 v89.92,51.35 | v97.66,52.07 v98.7,52.07 98.93,52.07 | v99.76,52.09 99.76,52.49 LED3.K
N$25  (via drill 0.2)
  Top 0.13: 61,48.41 60.84,48.41 60.2,49.05 60.2,50.56 61,51.36
  Top 0.203: v61.96,44.49 61.96,47.45 61,48.41 | 61,51.36 R19.1
  Bottom 0.203: IC2.11 IC2.10 39.41,42.07 40.98,40.5 40.98,39.46 41.8,38.65 47.09,38.65 49.98,41.54 54.39,41.54 54.49,41.64 60.92,41.64 61.13,41.85 61.13,43.38 61.96,44.21 v61.96,44.49
N$26  (via drill 0.2)
  Top 0.13: v95.57,69.77 91.71,69.77 v91.67,69.81 | v75.86,48.01 75.59,47.74 v75.59,46.9 | v75.01,44.55 75.61,43.95 79.29,43.95 79.81,43.43 79.81,42.71 79.29,42.2 76.47,42.2 75.19,40.91 v75.19,39.52 | v45.26,48.5 45.26,36.03 46.09,35.2 50.63,35.2 51.31,35.88 53.37,35.88 54.4,34.85 55.86,34.85 56.16,35.15 58.06,35.15 58.45,34.77 67.91,34.77 67.98,34.84 72.88,34.84 73.67,35.63 v73.67,38.89 | v89.92,52.11 89.29,52.11 88.89,52.51 88.89,63.57 89.84,64.52 v90.86,64.52 | 34.4,62.82 34.69,62.53 34.8,62.53 35.45,61.89 35.45,60.73 35.56,60.62 38.03,60.62 38.44,61.03 38.44,62.31 40.13,64 40.31,64
  Top 0.203: IC2.13 35.86,50.28 34.03,52.11 34.03,62.45 34.4,62.82 | 40.31,64 R20.2
  Bottom 0.13: C6.- 97.65,70.5 97.27,70.11 95.91,70.11 v95.57,69.77 | v91.67,69.81 91.91,69.57 91.91,66.4 92.08,66.24 92.08,64.98 91.48,64.38 | 91.48,64.38 91.37,64.28 | 91.48,64.38 91,64.38 v90.86,64.52 | v89.92,52.11 88.57,50.76 86.7,50.76 85.7,49.76 85.7,46.77 85.01,46.07 84.44,46.07 84.39,46.12 82.31,46.12 81.18,47.25 81.18,47.92 80.88,48.23 79.06,48.23 78.85,48.01 v75.86,48.01 | v75.59,46.9 75.59,45.12 v75.01,44.55 | v75.19,39.52 74.55,38.89 v73.67,38.89 | v45.26,48.5 40.08,48.5 39.41,47.83
  Bottom 0.203: IC2.13 39.41,47.83 IC2.12
N$27  (via drill 0.2)
  Top 0.203: v62.72,44.75 66.23,44.75 v66.33,44.65 | v92.71,66.73 93.13,67.15 v99.04,67.15
  Bottom 0.203: IC2.8 40.86,37.58 41.57,38.29 44.73,38.29 45.29,37.73 47.31,37.73 47.31,38.37 50.13,41.19 53.02,41.19 54.4,39.81 57.17,39.81 57.58,39.4 57.78,39.4 59.29,40.91 61.31,40.91 61.48,41.08 61.48,43.23 62.72,44.46 v62.72,44.75 | v66.33,44.65 67.96,44.65 68,44.69 70.66,44.69 72.14,43.21 75.46,43.21 76.94,44.69 79.6,44.69 81.05,43.24 86.66,43.24 89.38,45.97 89.38,49.38 90.79,50.79 90.79,62.85 92.71,64.77 v92.71,66.73 | v99.04,67.15 102.39,70.5 C6.+
N$28  (via drill 0.2)
  Top 0.15: v60.18,62.18 61.46,62.18 62.34,63.06 63.11,63.06 64.31,61.87 64.31,61.13 64.02,60.85 64.02,59.65 64.31,59.37 64.31,57.37 64.61,57.06 65.46,57.06 65.77,56.75 65.77,56.31 65.63,56.17 v65.63,52.29 | v79.03,54.04 79.03,48.51 v79.9,47.63 | v88.53,49.13 94.84,49.13 94.93,49.22 95.68,49.22 v95.9,49.45
  Bottom 0.15: R19.2 60.4,62.18 v60.18,62.18 | v65.63,52.29 65.63,51.97 66.7,50.9 68.37,50.9 68.95,51.48 69.39,51.48 69.85,51.02 69.93,51.02 72.04,53.14 72.04,54.64 72.94,55.54 75.05,55.54 75.34,55.83 75.78,55.83 75.93,55.69 76.91,55.69 77.72,54.88 78.06,54.88 78.29,55.11 78.72,55.11 79.03,54.8 v79.03,54.04 | v79.9,47.63 81.14,46.4 81.2,46.4 82.39,45.21 82.73,45.21 83.06,45.53 84.14,45.53 85.81,43.87 86.39,43.87 88.53,46 v88.53,49.13 | v95.9,49.45 98.53,49.45 98.86,49.12 100.89,49.12 LED4.K
N$30
  Bottom 0.13: R27.S 77.5,10.98 77.15,10.63 74.42,10.63 73.57,11.47 73.57,12.63 73.04,13.17 73.04,14.12 71.67,15.49 71.27,15.49 JP7.13
N$37  (via drill 0.2)
  Top 0.13: v81.39,8.96 v81.39,10.86 | v106.42,5.54 105.94,5.54 105.45,6.04 105.45,14.76 105.92,15.24 105.92,20.43 104.96,21.4 104.96,22.71 105.04,22.8 105.04,23.43 v104.53,23.95
  Top 0.15: v46.45,12.98 46.49,13.02 v49.38,13.02 | v51.06,13.01 51.06,8.44 51.13,8.36 51.13,5.17 v51.36,4.95
  Bottom 0.13: 67.77,8.17 67.77,9.01 67.75,9.03 67.75,9.84 68.33,10.41 73.05,10.41 73.96,9.5 75.79,9.5 75.8,9.51 80.51,9.51 81.06,8.96 v81.39,8.96 | v81.39,10.86 82.09,10.86 82.61,11.38 85.19,11.38 85.94,10.63 85.94,9.18 86.55,8.57 88.31,8.57 90.07,6.82 95.19,6.82 96.47,5.54 102.86,5.54 103.24,5.92 105.39,5.92 105.76,5.54 v106.42,5.54 | v104.53,23.95 106.41,25.83 IC8.15
  Bottom 0.15: J4.6 45.64,12.98 v46.45,12.98 | v49.38,13.02 v49.38,13.01 v51.06,13.01 | v51.36,4.95 53.04,4.95 55.86,7.78 57.92,7.78 58.44,7.26 58.44,5.99 59.77,4.65 61.62,4.65 62.96,5.99 62.96,7.26 63.48,7.78 67.37,7.78 67.77,8.17
N$38  (via drill 0.2)
  Top 0.15: v46.45,4.23 47.56,4.23 v47.6,4.19 | v49.02,4.26 50.08,4.26 v50.1,4.23 | v85.07,5.6 85.79,6.32 v85.79,6.46 | v104.83,4.8 104.6,5.03 104.6,18.11 v104.83,18.34
  Bottom 0.13: 80.37,8.39 74.36,8.39 73.97,8.01
  Bottom 0.15: J3.7 J3.8 43.16,1.85 45.84,1.85 45.84,3.29 46.5,3.96 46.5,4.18 v46.45,4.23 | v47.6,4.19 48.96,4.19 v49.02,4.26 | v50.1,4.23 51.37,2.96 51.47,2.96 51.69,2.73 54.66,2.73 54.83,2.91 54.83,4.2 55.86,5.24 57.92,5.24 58.44,4.72 58.44,4.54 59.23,3.75 62,3.75 63.48,5.24 65.77,5.24 66.72,4.29 68.07,5.64 71.8,5.64 72.92,4.52 73.03,4.52 73.97,5.46 73.97,8.01 | 80.37,8.39 81.03,7.73 81.03,5.89 81.55,5.38 84.84,5.38 v85.07,5.6 | v85.79,6.46 85.81,6.46 86.34,5.93 94.83,5.93 96.11,4.65 103.23,4.65 103.51,4.92 104.7,4.92 v104.83,4.8 | IC8.12 107.92,18.34 v104.83,18.34
N$39  (via drill 0.2)
  Top 0.13: 105.12,5.24 104.89,5.48 104.89,15.28 105.12,15.52
  Top 0.15: 105.12,15.52 v105.12,15.57 | 105.12,5.24 105.35,5.01 105.35,4.47 v105.46,4.36 | v85.79,8.15 85.79,7.2 84.49,5.9 v84.32,5.9 | v50.08,6.8 v49.02,6.8 | v47.56,6.77 v46.45,6.77
  Bottom 0.13: 80.26,8.92 74.14,8.92 73.67,8.45
  Bottom 0.15: IC8.11 105.22,15.67 v105.12,15.57 | v105.46,4.36 105.35,4.47 105.35,5.01 105.04,5.33 103.48,5.33 103.11,4.95 96.23,4.95 94.95,6.23 87.01,6.23 85.79,7.45 v85.79,8.15 | v84.32,5.9 84.09,5.67 81.67,5.67 81.33,6.02 81.33,7.86 80.26,8.92 | 73.67,8.45 73.67,5.58 73.52,5.43 72.26,6.69 72.26,7.3 71.68,7.88 70.86,7.88 70.63,7.64 69.37,7.64 69.14,7.88 68.32,7.88 67.74,7.3 67.74,7 66.09,5.35 65.9,5.54 63.36,5.54 61.87,4.05 59.35,4.05 58.74,4.67 58.74,4.84 58.04,5.54 55.74,5.54 54.53,4.33 54.53,3.19 54.37,3.04 52.05,3.04 50.32,4.76 50.08,4.76 50.53,5.21 50.53,6.03 50.08,6.48 v50.08,6.8 | v49.02,6.8 48.99,6.77 v47.56,6.77 | v46.45,6.77 46.45,6.45 46.03,6.03 46.03,4.64 J3.6
N$40  (via drill 0.2)
  Top 0.15: v46.36,2.02 48.67,2.02 49.89,0.8 50.33,0.8 50.64,1.11 50.64,1.83 v51.25,2.44 | v55.36,3.01 65.32,3.01 v66.28,3.98 | v74.38,4.66 75.62,4.66 v76.04,5.08 | v79.05,5.08 79.37,5.08 79.63,4.81 80.45,4.81 80.71,5.08 v81.1,5.08 | v91.19,5.04 91.52,5.04 91.72,5.25 92.54,5.25 92.66,5.13 v93.82,5.13 | v104.71,4.04 104.48,4.27 104.3,4.46 104.3,20.47 v104.53,20.7
  Bottom 0.15: J3.10 40.92,1.55 46.14,1.55 46.36,1.77 v46.36,2.02 | v51.25,2.44 54.78,2.44 v55.36,3.01 | v66.28,3.98 66.83,3.98 68.19,5.34 71.68,5.34 72.8,4.22 74.24,4.22 74.38,4.36 v74.38,4.66 | v76.04,5.08 v79.05,5.08 | v81.1,5.08 91.17,5.08 v91.19,5.04 | v93.82,5.13 94.14,5.13 94.26,5.25 95.08,5.25 95.98,4.35 103.35,4.35 103.63,4.62 104.13,4.62 104.48,4.27 v104.71,4.04 | v104.53,20.7 104.58,20.75 IC8.13
N$41  (via drill 0.2)
  Top 0.13: v105.89,5 105.17,5.72 105.17,14.88 105.64,15.36 105.64,20.32 104.74,21.22 104.47,21.22 104.29,21.4 104.29,22.77 v104.53,23.01
  Top 0.15: v46.45,8.29 v47.63,8.29 | v49.02,8.31 50.44,8.31 v50.61,8.14 | v81.92,7.88 v81.92,10.32
  Bottom 0.13: 76.3,9.22 74.03,9.22 73.38,8.57 73.38,8.02 73.1,7.74 72.26,7.74 72.22,7.78
  Bottom 0.15: J3.9 40.55,5.62 41.52,6.6 44.77,6.6 v46.45,8.29 | v47.63,8.29 48.99,8.29 v49.02,8.31 | v50.61,8.14 50.61,6.37 50.83,6.15 50.83,4.73 51.82,3.74 53.52,3.74 55.61,5.83 58.17,5.83 59.65,4.35 61.75,4.35 63.23,5.83 65.86,5.83 68.2,8.18 71.8,8.18 72.2,7.78 72.22,7.78 | 76.3,9.22 80.39,9.22 81.73,7.88 v81.92,7.88 | v81.92,10.32 81.96,10.32 82.73,11.09 85.07,11.09 85.65,10.51 85.65,9.06 86.53,8.18 87.35,8.18 87.45,8.29 88.19,8.29 89.95,6.53 95.07,6.53 96.35,5.25 102.98,5.25 103.36,5.62 105.27,5.62 v105.89,5 | v104.53,23.01 104.81,23.29 IC8.14
N$43  (via drill 0.2)
  Top 0.13: v46.45,10.14 48.41,10.14 v48.51,10.24 | v80.37,10.03 80.85,10.51 v80.85,11.39 | v104.53,24.71 104.53,24.68 105.32,23.89 105.32,22.68 105.24,22.59 105.24,21.51 106.2,20.55 106.2,15.12 105.73,14.65 105.73,6.25 105.91,6.07 v106.97,6.07
  Bottom 0.13: J4.8 43.6,10.14 v46.45,10.14 | v48.51,10.24 48.89,9.86 50.29,9.86 51.27,8.88 51.27,5.95 51.98,5.24 52.92,5.24 55.74,8.06 58.04,8.06 58.73,7.38 58.73,6.11 59.9,4.94 60.98,4.94 62.67,6.63 62.67,7.38 63.36,8.06 67.25,8.06 67.49,8.3 67.49,8.89 67.47,8.91 67.47,9.95 68.21,10.69 73.17,10.69 74.08,9.78 75.68,9.78 75.69,9.79 80.13,9.79 v80.37,10.03 | v80.85,11.39 82.23,11.39 82.49,11.66 85.31,11.66 86.22,10.74 86.22,9.3 86.66,8.86 88.42,8.86 90.18,7.1 95.31,7.1 96.44,5.96 102.89,5.96 103.12,6.2 106.84,6.2 v106.97,6.07 | v104.53,24.71 104.53,24.84 IC8.16
  Bottom 0.15: J4.8 J4.7
N$44  (via drill 0.2)
  Top 0.13: v103.42,24.37 v103.42,7.08 | v80.82,12.9 79.61,11.69 v79.61,11.06 | v47.78,16.87 47.41,16.5 v45.73,16.5 | v42.9,13.62 42.9,14.75 42.33,15.32 41.53,15.32 40.56,14.35 J4.9
  Bottom 0.13: IC8.17 108.05,30.27 106.51,28.73 106.51,27.23 104.51,25.23 104.31,25.23 103.46,24.37 v103.42,24.37 | v103.42,7.08 103.09,6.75 102.89,6.75 102.7,6.56 98.38,6.56 98.34,6.52 96.67,6.52 95.54,7.66 90.41,7.66 88.97,9.1 88.97,10.38 88.3,11.05 86.7,11.05 86.06,11.7 86.06,13.02 85.18,13.9 82.62,13.9 81.39,12.67 80.88,12.67 80.82,12.73 v80.82,12.9 | v79.61,11.06 78.89,10.35 74.59,10.35 74.58,10.34 74.31,10.34 73.29,11.35 73.29,12.52 72.86,12.95 68.33,12.95 68.1,12.72 67.71,12.72 67.71,10.98 66.91,10.18 66.91,8.75 66.85,8.68 66.05,9.48 66.05,9.79 65.53,10.3 63.49,10.3 62.97,9.79 62.97,8.47 62.11,7.61 62.11,6.87 61.24,6 59.63,6 59.29,6.34 59.29,7.61 58.43,8.47 58.43,9.79 57.91,10.3 55.87,10.3 55.35,9.79 55.35,8.47 53.66,6.77 51.83,6.77 51.83,13.44 49.95,15.32 49.33,15.32 v47.78,16.87 | v45.73,16.5 45.44,16.21 45.44,13.95 44.87,13.38 44.07,13.38 43.84,13.62 v42.9,13.62
N$45  (via drill 0.2)
  Top 0.13: J4.10 40.56,11.81 41.53,12.78 42.43,12.78 v42.55,12.9 | v49.31,10.38 49.1,10.38 48.72,10.76 48.29,10.76 48.19,10.66 v45.9,10.66 | v79.61,10.31 80.33,11.03 80.33,11.61 80.64,11.91 80.66,11.91 v80.9,12.15 | v106.29,6.71 106.29,6.81 106.01,7.09 106.01,14.53 106.48,15.01 106.48,20.66 105.6,21.54 105.6,24 105.04,24.56 105.04,24.92 104.29,25.68 104.29,32.96 v104.53,33.2
  Bottom 0.13: v42.55,12.9 43.5,11.95 43.5,11.41 44.25,10.66 v45.9,10.66 | v49.31,10.38 49.55,10.14 50.41,10.14 51.55,9 51.55,6.13 51.67,6.01 53.29,6.01 55.63,8.35 58.15,8.35 59.01,7.49 59.01,6.23 59.52,5.72 61.36,5.72 62.39,6.75 62.39,7.49 63.25,8.35 66.91,8.35 67.19,8.63 67.19,10.07 68.09,10.97 73.28,10.97 74.19,10.06 75.56,10.06 75.57,10.07 79.38,10.07 v79.61,10.31 | v80.9,12.15 81.26,12.15 82.73,13.62 85.07,13.62 85.78,12.9 85.78,11.58 86.58,10.78 88.18,10.78 88.69,10.26 88.69,8.98 90.3,7.38 95.43,7.38 96.56,6.24 102.78,6.24 103.01,6.47 106.18,6.47 106.29,6.58 v106.29,6.71 | v104.53,33.2 104.78,33.45 IC8.18
N$46  (via drill 0.2, 0.35)
  Top 0.13: 86.32,12.38 86.32,16.22 85.56,16.98
  Top 0.15: R33.1 85.39,48.21 85.39,44.36 85.76,43.99 85.76,40.65 84.39,39.27 84.39,35.42 85.61,34.2 85.61,33.28 86.86,32.03 86.86,30.22 86.58,29.94 86.58,26.68 85.56,25.66 85.56,16.98 | 86.32,12.38 86.32,1.56 86.44,1.44 86.44,1.63 v86.42,1.65
  Top 0.203: v73.67,0.53 78.92,0.53 79.52,1.12 79.52,2.59 Q1.C
  Bottom 0.15: v86.42,1.65 85.94,1.65 85.74,1.45 80.66,1.45 Q1.C
  Bottom 0.203: JP7.2 69.84,1.81 70.85,0.8 73.39,0.8 v73.67,0.53
N$47  (via drill 0.2)
  Top 0.13: R32.1 98.89,16.49 98.89,15.31 100.15,14.05 100.15,4.08 99.89,3.82 v99.89,2.06 | v81.16,0.54 81.16,1.94 v81.12,1.98 | v80.38,3.96 80.04,3.96 79.8,4.21 79.08,4.21 78.84,3.96 v78.5,3.96
  Bottom 0.13: v99.89,2.06 98.38,0.54 v81.16,0.54 | v81.12,1.98 80.38,2.72 v80.38,3.96 | v78.5,3.96 78.19,3.96 Q1.B
N$48
  Bottom 0.13: R26.S 78.34,19.84 79.21,18.97 82.86,18.97 83.42,19.52 84.38,19.52 85.71,18.2 85.71,17.87 86.18,17.4 R32.2
PA0/WK_UP
  Bottom 0.13: JP12.17 71.99,75.2 74.08,73.11 74.08,70.48 73.14,69.54 71.87,69.54
  Bottom 0.203: 71.87,69.54 JP2.34
PA1  (via drill 0.2)
  Top 0.13: v8.31,75.31 8.07,75.07 8.07,61.88 9.24,60.71 9.24,59.59 8.31,58.66 8.31,38.54 v8.66,38.19 | v16.46,40.19 16.22,39.95 16.22,36.13 v16.52,35.84